# EasyEDA schematic ElektroClub2025FLL_V2_schem.json
TITLE: ElektroClub 2025 FLL Limburg; REV: 2.0; Date: 2024-11-17; Sheet: 1/1; Drawn By: Maarten Pennings; Company: Maarten Pennings
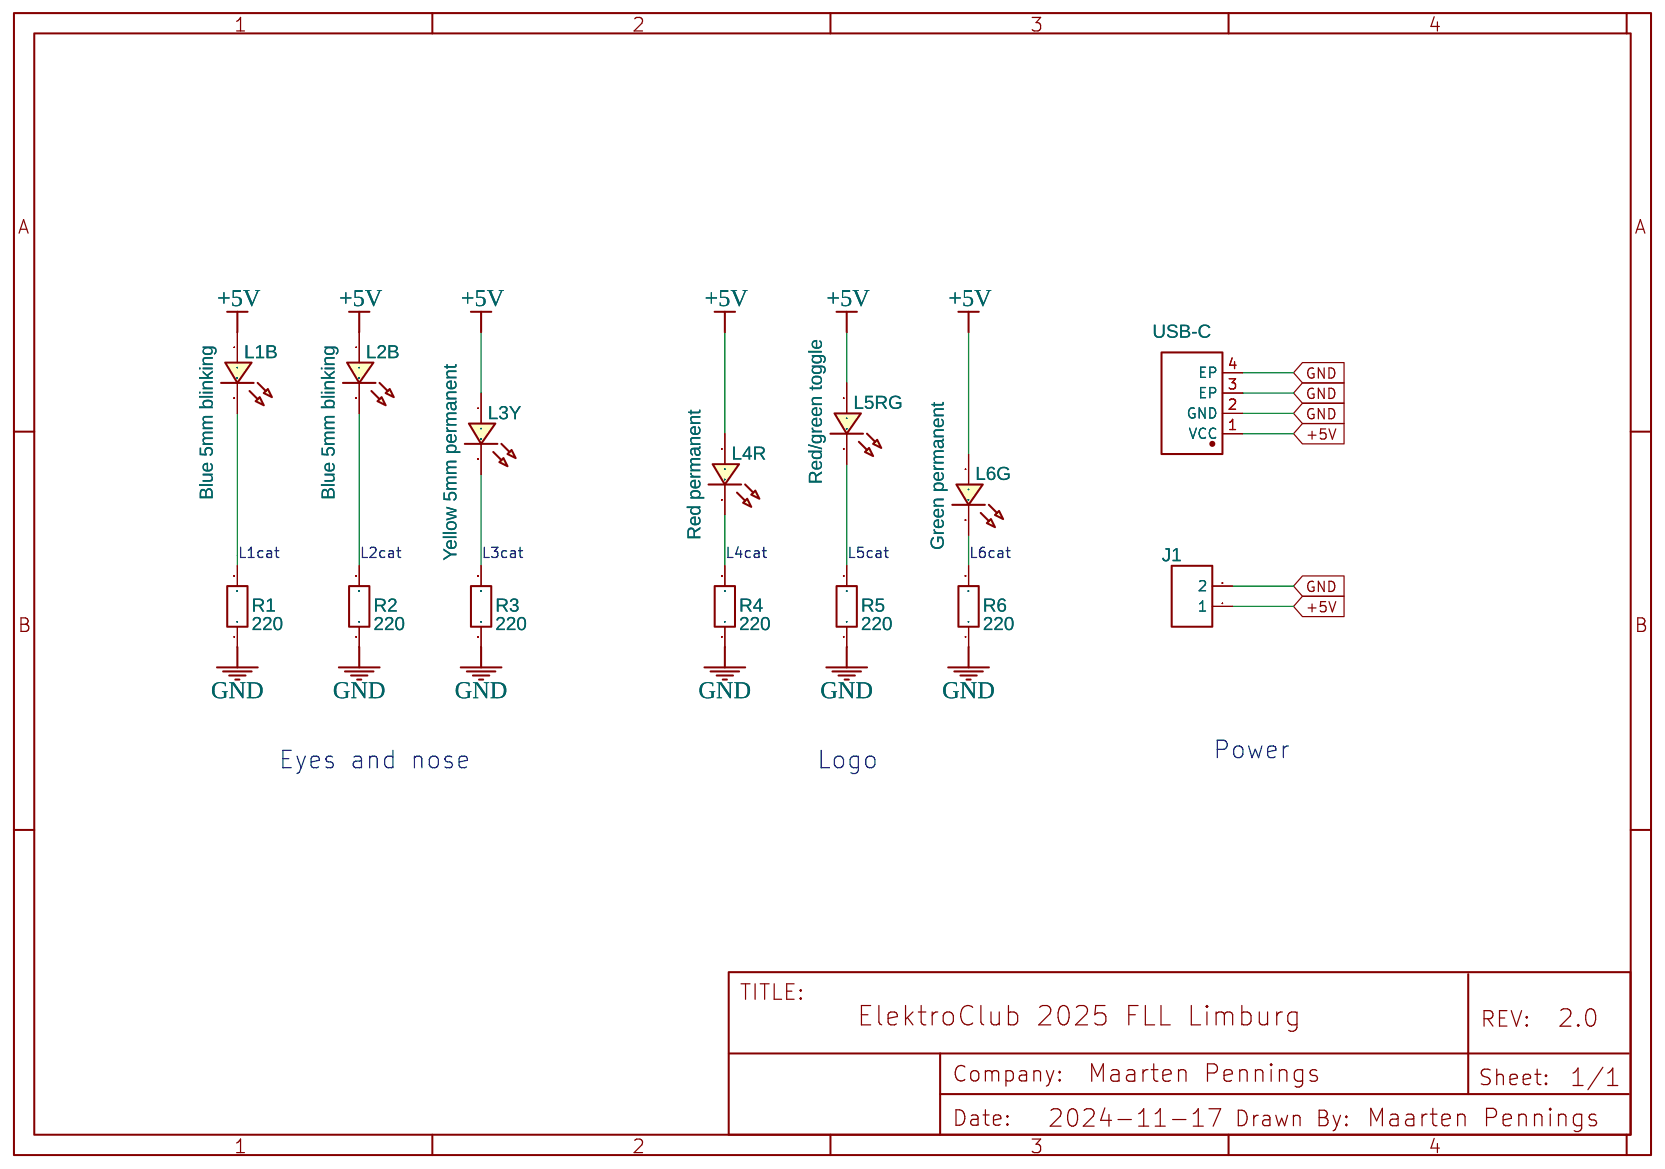
[diagram p0: schematic sheet]

## Parts
J1  HDR-M-2.54_1x2  [HDR-M-2.54_1X2]
L1B  Blue 5mm blinking  [LED-TH_BD5.0_GREEN]
L2B  Blue 5mm blinking  [LED-TH_BD5.0_GREEN]
L3Y  Yellow 5mm permanent  [LED-TH_BD5.0_GREEN]
L4R  Red permanent  [LED-TH_BD5.0_RED]
L5RG  Red/green toggle  [LED-TH_BD5.0_BLUE]
L6G  Green permanent  [LED-TH_BD5.0_BLUE]
R1  220  [R_AXIAL-0.4]
R2  220  [R_AXIAL-0.4]
R3  220  [R_AXIAL-0.4]
R4  220  [R_AXIAL-0.4]
R5  220  [R_AXIAL-0.4]
R6  220  [R_AXIAL-0.4]
USB-C  KH-TYPE-C-2P  [USB-SMD_KH-TYPE-C-2P]

## Library data of the parts
J1 = HDR-M-2.54_1x2: Supplier Part: C124375; Supplier: LCSC; Contributor: LCEDA_Lib
L1B L2B L3Y = LED-TH-5mm_G: Manufacturer: EVERLIGHT(台湾亿光); Manufacturer Part: 333-2SYGD/S530-E2; Supplier Part: C88163; Supplier: LCSC; Contributor: LCEDA_Lib
L4R = LED-TH-5mm_R: Manufacturer: EVERLIGHT(台湾亿光); Manufacturer Part: 333-2SURD/S530-A3; Supplier Part: C87271; Supplier: LCSC; Contributor: LCEDA_Lib
L5RG L6G = LED-TH-5mm_B: Supplier: LCSC; Contributor: LCEDA_Lib
R1-R6 = R_AXIAL-0.4_EU: Contributor: LCEDA_Lib
USB-C = KH-TYPE-C-2P: Contributor: LCSC; Supplier: LCSC; Supplier Part: C2919656; Manufacturer: kinghelm(金航标); JLCPCB Part Class: Extended Part

## Nets
+5V: J1.1 L1B.1 L2B.1 L3Y.1 L4R.1 L5RG.1 L6G.1 USB-C.1(VCC)
GND: J1.2 R1.1 R2.1 R3.1 R4.1 R5.1 R6.1 USB-C.2(GND) USB-C.3(EP) USB-C.4(EP)
L1cat: L1B.2 R1.2
L2cat: L2B.2 R2.2
L3cat: L3Y.2 R3.2
L4cat: L4R.2 R4.2
L5cat: L5RG.2 R5.2
L6cat: L6G.2 R6.2

## Notes on the sheet
- Eyes and nose
- Logo
- Power
